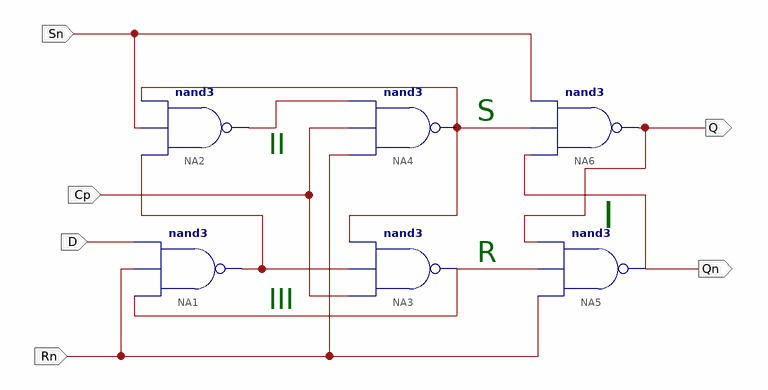
[diagram p0: schematic sheet 1]
// Xilinx ISE schematic MB_DFF.sch (spartan3) as structural Verilog: 6 symbols, 6 ports
module MB_DFF (
  input  Sn,
  input  Rn,
  input  D,
  input  Cp,
  output Q,
  output Qn
);

  wire XLXN_5, XLXN_15, XLXN_50, XLXN_111;

  nand NA2 (XLXN_50, XLXN_15, Sn, XLXN_111);
  nand NA3 (XLXN_5, Cp, XLXN_15, XLXN_111);
  nand NA1 (XLXN_15, XLXN_5, Rn, D);
  nand NA4 (XLXN_111, Rn, Cp, XLXN_50);
  nand NA6 (Q, Qn, XLXN_111, Sn);
  nand NA5 (Qn, Rn, XLXN_5, Q);

  // Notes on the sheet:
  //   S
  //   II
  //   I
  //   R
  //   III
endmodule
